# EAGLE design lipo_v1_1 (EAGLE 5.11)
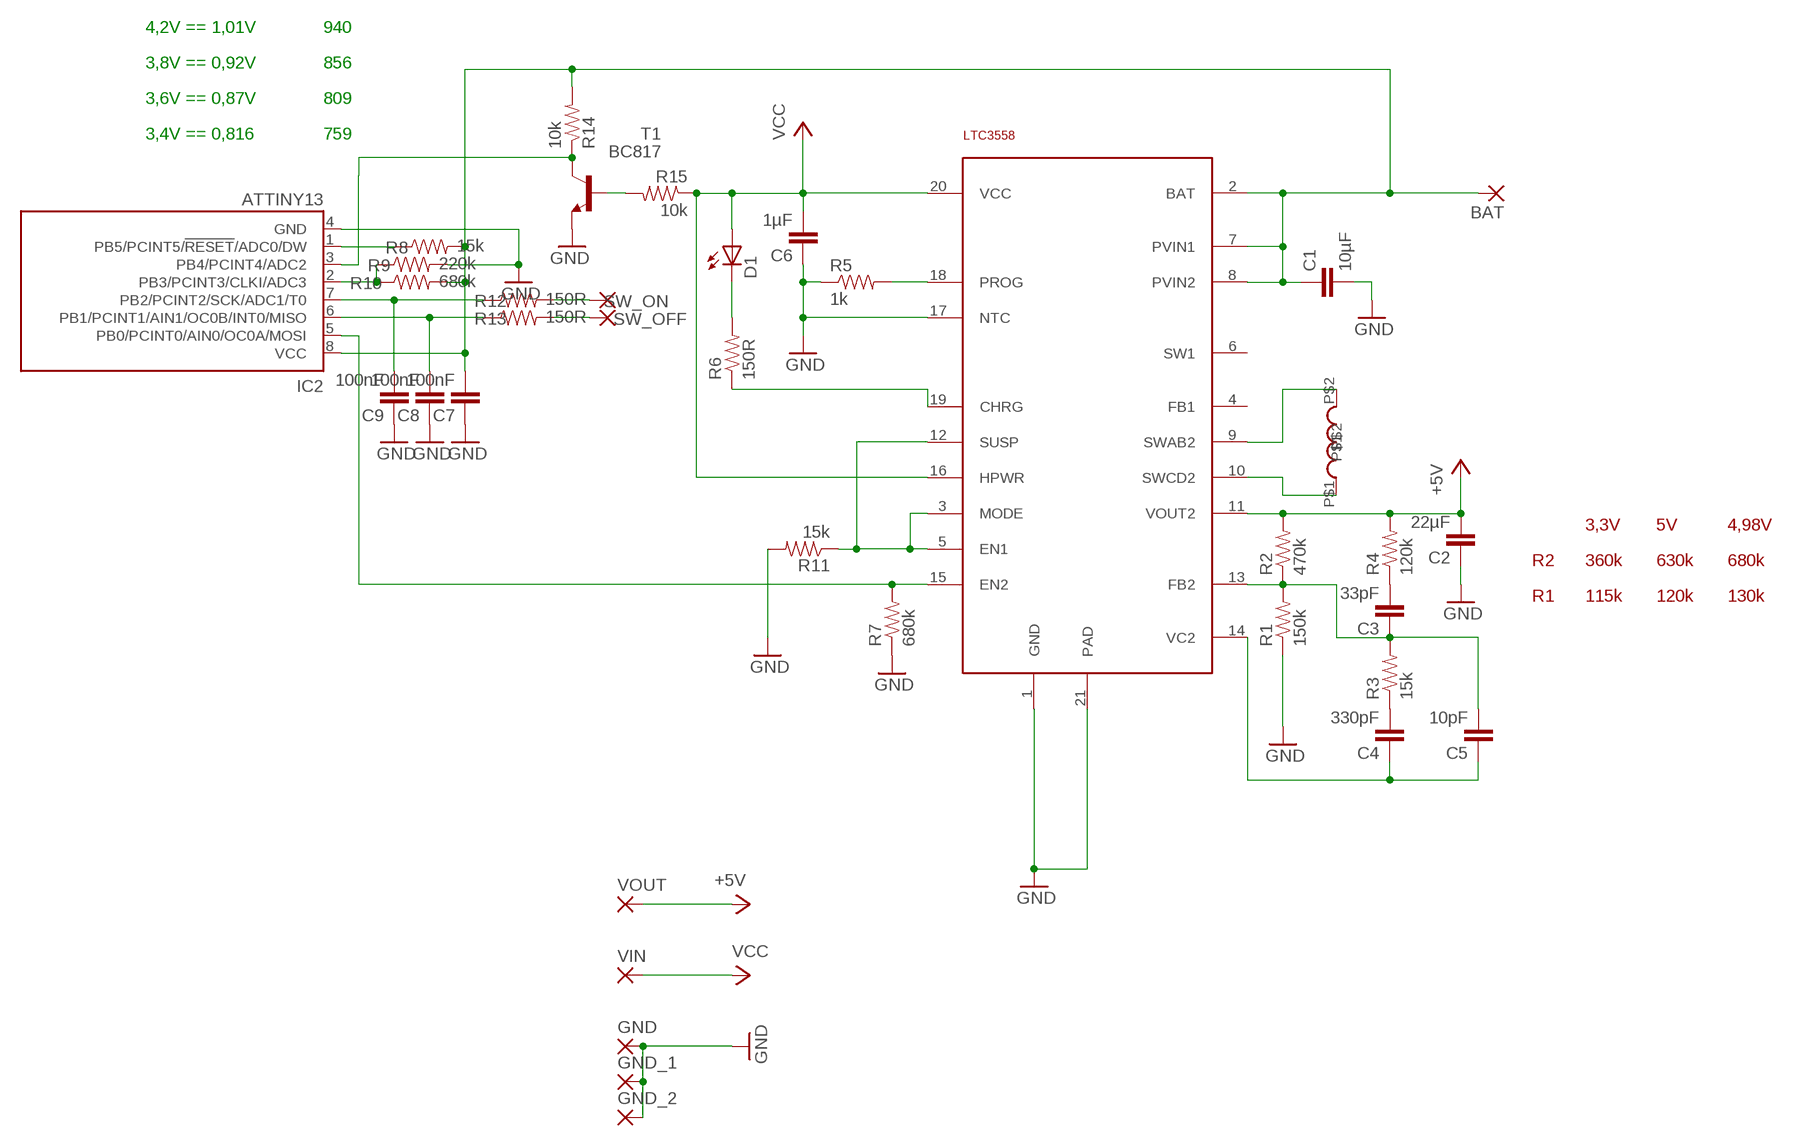
[diagram p0: schematic, sheet 1]

## Parts
BAT  SMD5  [SMD2,54-5,08]
C1  10µF  CAP0805  [0805]
C2  22µF  CAP0805  [0805]
C3  33pF  CAP0805  [0805]
C4  330pF  CAP0805  [0805]
C5  10pF  CAP0805  [0805]
C6  1µF  CAP0805  [0805]
C7  100nF  CAP0805  [0805]
C8  100nF  CAP0805  [0805]
C9  100nF  CAP0805  [0805]
D1  LEDCHIPLED_0805  [CHIPLED_0805]
GND  SMD5  [SMD2,54-5,08]
GND_1  SMD5  [SMD2,54-5,08]
GND_2  SMD5  [SMD2,54-5,08]
IC1  LTC3558  [UD-QFN20]
IC2  ATTINY13  TINY13-20SU  [8S2]
L1  2,2µH  SMD-INDUCTOR-4012  [SMD4012]
R1  150k  RESISTOR  [0805]
R2  470k  RESISTOR  [0805]
R3  15k  RESISTOR  [0805]
R4  120k  RESISTOR  [0805]
R5  1k  RESISTOR  [0805]
R6  150R  RESISTOR  [0805]
R7  680k  RESISTOR  [0805]
R8  15k  RESISTOR  [0805]
R9  220k  RESISTOR  [0805]
R10  680k  RESISTOR  [0805]
R11  15k  RESISTOR  [0805]
R12  150R  RESISTOR  [0805]
R13  150R  RESISTOR  [0805]
R14  10k  RESISTOR  [0805]
R15  10k  RESISTOR  [0805]
SW_OFF  SMD5  [SMD2,54-5,08]
SW_ON  SMD5  [SMD2,54-5,08]
T1  BC817  BC847  [SOT23]
VIN  SMD5  [SMD2,54-5,08]
VOUT  SMD5  [SMD2,54-5,08]

## Nets
+5V: C2.2 IC1.11(VOUT2) R2.2 R4.2 VOUT.1(P)
BAT: BAT.1(P) C1.1 C7.2 IC1.2(BAT) IC1.7(PVIN1) IC1.8(PVIN2) IC2.8(VCC) R8.2 R10.2 R14.2
EN2: IC1.15(EN2) IC2.5(PB0/PCINT0/AIN0/OC0A/MOSI) R7.2
GND: C1.2 C2.1 C6.1 C7.1 C8.1 C9.1 GND.1(P) GND_1.1(P) GND_2.1(P) IC1.1(GND) IC1.17(NTC) IC1.21(PAD) IC2.4(GND) R1.1 R5.1 R7.1 R9.2 R11.2 T1.2(E)
N$1: C3.1 C5.2 IC1.13(FB2) R1.2 R2.1 R3.2
N$2: D1.C R6.2
N$3: IC1.18(PROG) R5.2
N$4: C3.2 R4.1
N$5: C4.2 R3.1
N$6: C4.1 C5.1 IC1.14(VC2)
N$8: IC1.10(SWCD2) L1.P$1
N$9: IC1.9(SWAB2) L1.P$2
N$10: IC1.19(CHRG) R6.1
N$11: R15.2 T1.1(B)
N$12: IC2.2(PB3/PCINT3/CLKI/ADC3) R9.1 R10.1
N$13: IC2.1(PB5/PCINT5/!RESET!/ADC0/DW) R8.1
N$14: R12.2 SW_ON.1(P)
N$15: R13.2 SW_OFF.1(P)
N$16: IC1.3(MODE) IC1.5(EN1) IC1.12(SUSP) R11.1
N$17: C8.2 IC2.6(PB1/PCINT1/AIN1/OC0B/INT0/MISO) R13.1
N$18: C9.2 IC2.7(PB2/PCINT2/SCK/ADC1/T0) R12.1
USBSENSE: IC2.3(PB4/PCINT4/ADC2) R14.1 T1.3(C)
VCC: C6.2 D1.A IC1.16(HPWR) IC1.20(VCC) R15.1 VIN.1(P)
Unconnected: IC1.4(FB1) IC1.6(SW1)

## Notes on the sheet
- 4,2V == 1,01V | 940
- 3,8V == 0,92V | 856
- 3,6V == 0,87V | 809
- 3,4V == 0,816 | 759
- 3,3V | 5V | 4,98V
- R2 | 360k | 630k | 680k
- R1 | 115k | 120k | 130k

## Library data of the parts
BAT GND GND_1 GND_2 SW_OFF SW_ON VIN VOUT = wirepad:SMD5: SMD PAD
C1-C9 = SparkFun:CAP: Capacitor Standard 0603 ceramic capacitor, and 0.1" leaded capacitor.
D1 = led:LED: LED OSRAM: - CHIPLED LG R971, LG N971, LY N971, LG Q971, LY Q971, LO R971, LY R971 LH N974, LH R974 LS Q976, LO Q976, LY Q976 LO Q996 - Hyper CHIPLED LW Q18S LB Q993, LB Q99A, LB R99A - SideLED LS A670, LO A670, LY A670, LG A670, LP A670 LB A673, LV A673, LT A673, LW A673 LH A674 LY A675 LS A676, LA A676, LO A676, LY A676, LW A676 LS A679, LY A679, LG A679 - Hyper Micro SIDELED® LS Y876, LA Y876, LO Y876, LY Y876 LT Y87S - SmartLED LW L88C, LW L88S LB L89C, LB L89S, LG L890 LS L89K, LO L89K, LY L89K LS L896, LA L896, LO L896, LY L896 - TOPLED LS T670, LO T670, LY T670, LG T670, LP T670 LSG T670, LSP T670, LSY T670, LOP T670, LYG T670 LG T671, LOG T671, LSG T671 LB T673, LV T673, LT T673, LW T673 LH T674 LS T676, LA T676, LO T676, LY T676, LB T676, LH T676, LSB T676, LW T676 LB T67C, LV T67C, LT T67C, LS T67K, LO T67K, LY T67K, LW E67C LS E67B, LA E67B, LO E67B, LY E67B, LB E67C, LV E67C, LT E67C LW T67C LS T679, LY T679, LG T679 LS T770, LO T770, LY T770, LG T770, LP T770 LB T773, LV T773, LT T773, LW T773 LH T774 LS E675, LA E675, LY E675, LS T675 LS T776, LA T776, LO T776, LY T776, LB T776 LHGB T686 LT T68C, LB T68C - Hyper Mini TOPLED® LB M676 - Mini TOPLED Santana® LG M470 LS M47K, LO M47K, LY M47K Source: http://www.osram.convergy.de LUXEON: - LUMILED® LXK2-PW12-R00, LXK2-PW12-S00, LXK2-PW14-U00, LXK2-PW14-V00 LXK2-PM12-R00, LXK2-PM12-S00, LXK2-PM14-U00 LXK2-PE12-Q00, LXK2-PE12-R00, LXK2-PE12-S00, LXK2-PE14-T00, LXK2-PE14-U00 LXK2-PB12-K00, LXK2-PB12-L00, LXK2-PB12-M00, LXK2-PB14-N00, LXK2-PB14-P00, LXK2-PB14-Q00 LXK2-PR12-L00, LXK2-PR12-M00, LXK2-PR14-Q00, LXK2-PR14-R00 LXK2-PD12-Q00, LXK2-PD12-R00, LXK2-PD12-S00 LXK2-PH12-R00, LXK2-PH12-S00 LXK2-PL12-P00, LXK2-PL12-Q00, LXK2-PL12-R00 Source: www.luxeon.com KINGBRIGHT: KA-3528ASYC Source: www.kingbright.com
IC1 = seb:LTC3558
IC2 = atmel:TINY13: 8-bit AVR Microcontroller with 1K Bytes In-System Programmable Flash Source: http://www.atmel.com/dyn/resources/prod_documents/2535S.pdf; MPN: ATTINY13-20SU; OC_FARNELL: 9171568; OC_NEWARK: 96K6522
L1 = seb:SMD-INDUCTOR-4012
R1-R15 = SparkFun:RESISTOR: Resistor Basic schematic elements and footprints for 0603, 1206, and PTH 1/10th watt (small) resistors.
T1 = transistor:BC847: NPN TRANSISTOR

## Board
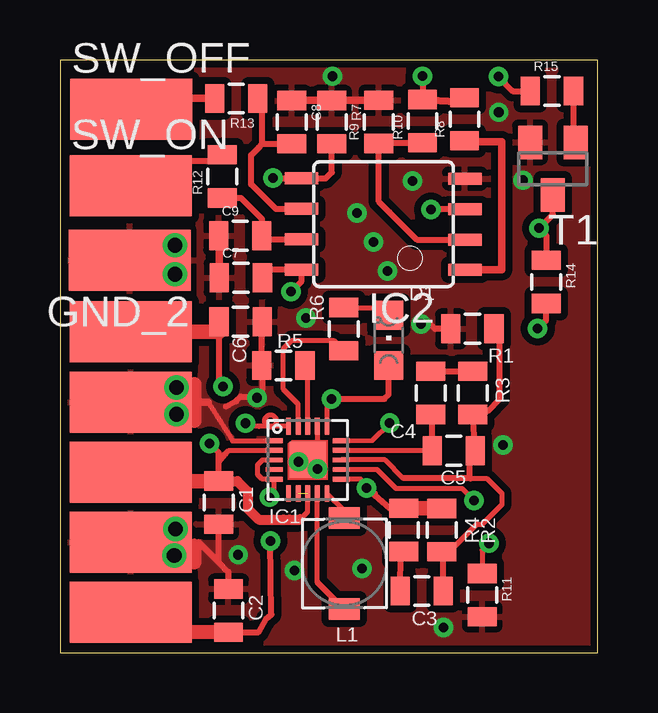
[diagram p1: board, top side]
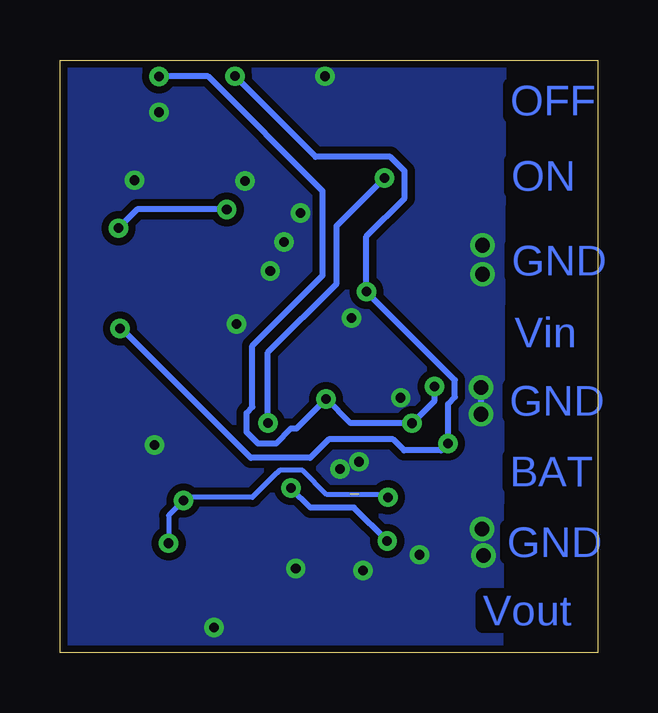
[diagram p2: board, bottom side, seen from below]

Size 22.4 x 24.7 mm. Coordinates in mm from the lower left corner, seen from the top.
Outline: 0,0 22.4,0 22.4,24.7 0,24.7 0,0
Copper layers (1*16): Top 0.035mm / dielectric 1.5mm / Bottom 0.035mm
Design rules "default *": minimum track width 0.2mm, minimum drill 0.3mm, track to track 0.2mm, track to pad 0.2mm, pad to pad 0.2mm, via to via 0.2mm, smd to smd 0.2mm, copper to edge 0.2mm, drill to drill 0.2mm, minimum pad ring 10mil, minimum via ring 8mil, stop-mask expansion 4mil, vias tented up to drill 100mil, thermal gap 10mil

### Footprints (pad centres in the part's own frame; a part is rotated, then mirrored left to right if it is on the bottom)
SMD2,54-5,08 = smd 2.54 x 5.08: 1 0,0
0805 = smd 0.8 x 1.2: 1 -0.9,0; 2 0.9,0
CHIPLED_0805 = smd 1.2 x 1.2: A 0,-1.05; C 0,1.05
UD-QFN20 = smd 0.7 x 0.2: 1 -1.4,0.8; 2 -1.4,0.4; 3 -1.4,0; 4 -1.4,-0.4; 5 -1.4,-0.8; 11 1.4,-0.8; 12 1.4,-0.4; 13 1.4,0; 14 1.4,0.4; 15 1.4,0.8 | smd 0.2 x 0.7: 6 -0.8,-1.4; 7 -0.4,-1.4; 8 0,-1.4; 9 0.4,-1.4; 10 0.8,-1.4; 16 0.8,1.4; 17 0.4,1.4; 18 0,1.4; 19 -0.4,1.4; 20 -0.8,1.4 | smd 1.5 x 1.5: 21 0,0
8S2 = smd 0.5 x 1.4: 1 -1.905,-3.404; 2 -0.645,-3.404; 3 0.625,-3.404; 4 1.895,-3.404; 5 1.905,3.404; 6 0.635,3.404; 7 -0.635,3.404; 8 -1.905,3.404
SMD4012 = smd 0.9 x 1.3: P$1 -1.9,0; P$2 1.9,0
SOT23 = smd 1 x 1.4: 1 -0.95,-1.1; 2 0.95,-1.1; 3 0,1.1

### Placement (x,y rotation side)
BAT  2.96,7.53 90 top
C1  6.61,6.26 270 top
C2  7.02,1.76 270 top
C3  15.07,2.57 180 top
C4  15.45,10.83 90 top
C5  16.41,8.42 0 top
C6  7.53,13.8 180 top
C7  7.53,15.63 0 top
C8  9.66,22.11 270 top
C9  7.51,17.38 0 top
D1  13.7,13.02 0 top
GND  2.96,10.45 90 top
GND_1  2.96,4.61 90 top
GND_2  2.91,16.36 90 top
IC1  10.32,8.04 0 top
IC2  13.47,17.86 90 top
L1  11.85,3.72 270 top
R1  17.18,13.5 0 top
R2  15.91,5.11 90 top
R3  17.2,10.83 270 top
R4  14.33,5.12 90 top
R5  9.31,11.97 0 top
R6  11.82,13.49 90 top
R7  11.32,22.12 270 top
R8  16.85,22.23 90 top
R9  13.28,22.12 90 top
R10  15.1,22.15 90 top
R11  17.59,2.4 270 top
R12  6.76,19.85 90 top
R13  7.34,23.1 180 top
R14  20.26,15.45 270 top
R15  20.5,23.41 0 top
SW_OFF  2.97,22.66 270 top
SW_ON  2.95,19.47 270 top
T1  20.53,20.17 180 top
VIN  2.96,13.37 90 top
VOUT  2.96,1.69 270 top

### Tracks (layer width: path | path; a pad name or v marks a point on that pad's centre or on a via)
+5V  (via drill 0.4 pad 0.3)
  Top 0.203: 13.12,6.64 12.52,7.24 IC1.11
  Top 0.254: 13.12,6.64 v12.78,6.87 13.74,6.02 R4.2 | v8.77,4.66 8.8,1.59 8.59,1.41 8.28,0.86 C2.2
  Top 0.61: VOUT.1 3.16,0.88 C2.2 | R4.2 R2.2
  Bottom 0.254: v8.77,4.66 10.16,6.05 11.47,6.05 11.96,6.05 v12.78,6.87
BAT  (via drill 0.4)  (1 unrouted)
  Top 0.203: IC1.8 10.32,5.88 9.99,5.55 | IC1.2 7.04,8.44 6.89,8.29
  Top 0.254: 7.03,7.16 C1.1 6.61,7.76 | 9.31,5.55 9.99,5.65 | 6.89,8.29 6.61,7.96 6.61,7.76 | 8.85,5.55 9.56,5.55 | v6.23,8.73 6.61,8.34 6.61,7.76 | R10.2 v15.11,24.03 | v9.63,15.05 10.06,15.48 IC2.8 8.76,15.95 C7.2 | R14.2 20.26,13.87 v19.9,13.51
  Top 0.305: R10.2 16.54,22.97 R8.2
  Top 0.406: 9.99,5.55 9.56,5.55 9.31,5.55 8.85,5.55 8.29,5.55 7.83,6 7.83,6.72 7.39,7.16 C1.1
  Top 0.61: C1.1 3.33,7.16 BAT.1
  Bottom 0.254: v15.11,24.03 11.75,20.66 8.63,20.66 8.04,20.07 8.04,18.94 9.63,17.35 v9.63,15.05 5.94,11.36 5.94,10.66 6.23,10.38 v6.23,8.73 6.52,8.44 8.06,8.44 8.52,8.9 11.21,8.9 11.98,8.12 14.44,8.12 19.83,13.51 v19.9,13.51
EN2  (via drill 0.4)
  Top 0.2: 10.35,19.77 IC2.5
  Top 0.203: IC1.15 13.01,8.85 v13.74,9.57
  Top 0.254: v8.88,19.78 10.35,19.77 | R7.2 11.33,20.02 11.2,19.9 11.07,19.76 IC2.5
  Bottom 0.254: v13.74,9.57 13.74,9.65 13.74,12.52 10.87,15.39 10.87,17.58 10.87,17.79 v8.88,19.78
GND  (via drill 0.4 pad 0.3, 0.61 pad 0.3)
  Top 0.203: IC1.1 7.19,8.83 6.18,10.45 | GND.1 5.29,10.45 | IC1.17 10.72,8.44 IC1.21
  Top 0.254: R5.1 8.29,11.86 | R5.1 8.41,13.5 C6.1 | IC1.21 10.32,7.64 | 5.29,10.45 5.27,10.45 v4.86,11.06 | R5.1 8.44,11.94 8.44,10.98 8.14,10.68 7.53,10.68 7.33,10.47 6.92,10.27 | R1.1 15.63,13.5 15.22,13.9 | C2.1 7.02,3.36 6.61,3.77 | 6.61,3.77 C1.2 | 6.61,3.77 5.78,4.61 5.6,4.61 GND_1.1
  Top 0.305: 5.29,10.45 6.18,10.45 | 5.6,9.66 5.32,9.94 v4.86,9.94 | 5.6,4.61 5.6,4.38 | R9.2 R7.1 C8.1 | C9.1 6.63,17.38 C7.1
  Top 0.61: 5.6,4.38 5.6,3.77 | 5.6,9.66 5.6,11.19
  Bottom 0.254: v4.86,11.06 v4.86,9.94
  other vias: 4.81,5.17 13.64,15.91 18.47,8.66 4.76,4.05 9.94,7.96 10.73,7.65 12.58,3.51 15.05,13.7 8.2,10.63 7.42,4.09 12.37,18.33 15.98,1.06 18.28,22.52 19.29,19.69 10.25,13.95 11.36,24.02 4.79,16.98 4.79,15.77 14.69,19.66 13.07,17.12 9.78,3.43
  pour Top (isolate 0.3): 0.34,25.11 22.47,24.73 22.54,0.04 0.42,0.42
  pour Bottom (isolate 0.3): 3.93,24.86 4.06,-0.03 22.52,-0.17 22.38,24.72
N$1
  Top 0.2: R2.1 16.22,4.21 17.37,5.37 17.6,5.37 18.42,6.19 18.42,6.63 17.8,7.25 17.11,7.25 17.08,7.27
  Top 0.203: IC1.13 13.55,8.04 14.31,7.27
  Top 0.254: R3.2 16.79,9.93 | R3.2 17.3,8.47 17.05,8.42 C5.2 17.19,8.29 17.08,8.18 17.08,7.27 14.31,7.27 | C3.1 15.97,4.2 R2.1 | R1.2 18.33,13.11 18.32,13.12 18.32,10.58 17.81,10.07 16.94,10.07 R3.2
N$2
  Top 0.2: R6.2 13.18,14.39 D1.C
  Top 0.254: D1.C 13.5,13.76
N$3
  Top 0.203: IC1.18 10.32,11.86 R5.2
N$4
  Top 0.254: C3.2 14.19,4.22 R4.1
N$5
  Top 0.254: C4.2 R3.1
N$6
  Top 0.203: IC1.14 15.25,8.44
  Top 0.254: 15.25,8.44 C5.1 15.51,9.92 C4.1
N$8
  Top 0.203: 11.85,5.91 IC1.10
  Top 0.254: L1.P$1 11.85,5.91
N$9
  Top 0.203: 10.72,2.94 IC1.9
  Top 0.254: L1.P$2 10.72,2.94
N$10
  Top 0.2: 10.88,13.01 11.4,13.01 R6.1
  Top 0.203: IC1.19 9.92,10.37 9.51,10.78 9.31,10.98 9.31,12.66 9.66,13.01 10.88,13.01 | 11.69,12.71 11.79,12.61 11.85,12.56 R6.1
N$11
  Top 0.254: T1.1 21.4,21.36 R15.2
N$12
  Top 0.254: IC2.2 14.87,17.21 13.72,18.36 13.28,18.8 R9.1 13.31,21.25 R10.1
  Top 0.305: R10.1 15.44,21.12
N$13
  Top 0.305: IC2.1 18.4,15.95 18.4,21.29 17.11,21.29 R8.1
N$14
  Top 0.254: 3.05,20.25 5.05,20.25 5.3,20.5 6.51,20.5 R12.2
  Top 0.305: SW_ON.1 3.05,20.25
N$15
  Top 0.305: SW_OFF.1 4.05,23.25 4.05,23.1 R13.2
N$16  (via drill 0.4)
  Top 0.2: IC1.5 8.92,6.67 v8.73,6.48 | v17.25,6.35 16.75,6.84 14,6.84 13.21,7.64 | R11.1 17.59,4.28 v17.87,4.56
  Top 0.203: 13.21,7.64 IC1.12 | IC1.3 8.44,8.04 8.24,7.83 8.24,7.43 8.43,7.24 IC1.5
  Bottom 0.2: v8.73,6.48 8.84,6.59 11.28,6.59 12.29,7.6 13.25,7.6 13.37,7.48 13.39,7.48 14.38,6.48 17.12,6.48 v17.25,6.35 17.87,5.73 v17.87,4.56
N$17
  Top 0.254: IC2.6 8.99,18.49 7.96,19.52 7.96,20.74 8.28,21.05 8.44,21.21 | 8.44,21.21 C8.2 | 8.29,23.1 8.44,22.95 8.44,21.21
  Top 0.305: 8.29,23.1 R13.1 | C8.2
N$18
  Top 0.254: IC2.7 8.57,17.22 C9.2 8.41,18.08 8.2,18.29 7.54,18.95 R12.1
USBSENSE  (via drill 0.4)
  Top 0.254: IC2.3 15.47,18.48 v15.45,18.47 | T1.3 20.53,18.26 v19.96,17.69 20.26,17.4 R14.1
  Bottom 0.254: v15.45,18.47 19.19,18.47 v19.96,17.69
VCC  (via drill 0.4, 0.4 pad 0.3)
  Top 0.2: 8.29,9.44 7.86,9.44 v7.73,9.56
  Top 0.203: IC1.20 8.29,9.44 | IC1.16 11.12,10.38 v11.31,10.58
  Top 0.254: v6.79,11.1 6.63,11.17 C6.2 | v11.31,10.58 13.52,10.58 13.7,10.75 D1.A | v18.27,24.02 18.27,24.01 18.87,23.41 R15.1
  Top 0.61: C6.2 6.63,13.37 VIN.1
  Bottom 0.254: v6.79,11.1 6.79,10.51 v7.73,9.56 10.3,9.56 v11.31,10.58 12.55,9.34 12.78,9.34 13.4,8.72 14.15,8.72 14.63,9.2 14.63,10 14.38,10.25 14.38,12.8 11.46,15.73 11.46,19.24 16.23,24.02 v18.27,24.02
(copper drawn outside any net)
  shapes: Top circle x1

### Text on the board
Bottom: OFF | ON | GND | Vin | GND | BAT | GND | Vout
tValues: 62k | 5V | 330k | bridge those pins
tStop: LiPo-Controller | seb@exse.net
bStop: seb@exse.net | LiPo-Controller